# EAGLE schematic self-balancing-robot (EAGLE 9.6.2)
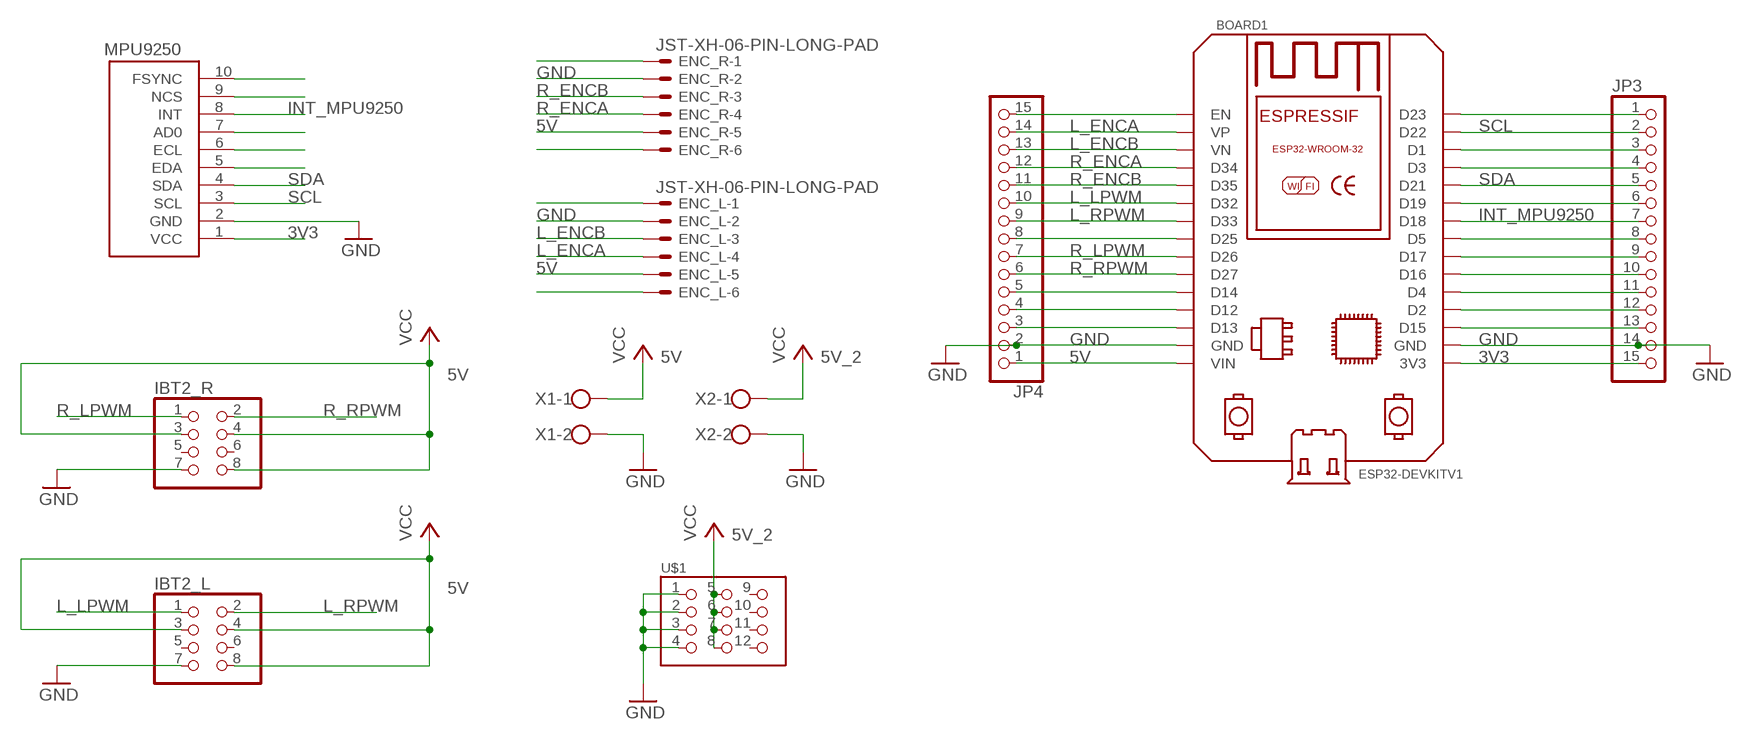
[diagram p0: schematic, sheet 1]

## Parts
BOARD1  ESP32DEVKITV1  [ESP32-DEVKITV1]
ENC_L  JST-XH-06-PIN-LONG-PAD  [JST-XH-06-PACKAGE-LONG-PAD]
ENC_R  JST-XH-06-PIN-LONG-PAD  [JST-XH-06-PACKAGE-LONG-PAD]
IBT2_L  PINHD-2X4  [2X04]
IBT2_R  PINHD-2X4  [2X04]
JP3  PINHD-1X15  [1X15]
JP4  PINHD-1X15  [1X15]
MPU9250  IMU-MODULE  [IMU-MODULE]
U$1  PIN_3X4  [PIN_3X4]
X1  W237-102  [W237-102]
X2  W237-102  [W237-102]

## Nets
3V3: BOARD1.3V3 JP3.15 MPU9250.1(VCC)
5V: BOARD1.VIN ENC_L.5 ENC_R.5 IBT2_L.3 IBT2_L.4 IBT2_L.8 IBT2_R.3 IBT2_R.4 IBT2_R.8 JP4.1 X1.1 ; supply symbol labelled VCC
5V_2: U$1.5 U$1.6 U$1.7 U$1.8 X2.1 ; supply symbol labelled VCC
GND: BOARD1.GND BOARD1.GND@1(GND) ENC_L.2 ENC_R.2 IBT2_L.7 IBT2_R.7 JP3.14 JP4.2 MPU9250.2(GND) U$1.1 U$1.2 U$1.3 U$1.4 X1.2 X2.2
INT_MPU9250: BOARD1.D18 JP3.7 MPU9250.8(INT)
L_ENCA: BOARD1.VP ENC_L.4 JP4.14
L_ENCB: BOARD1.VN ENC_L.3 JP4.13
L_LPWM: BOARD1.D32 IBT2_L.1 JP4.10
L_RPWM: BOARD1.D33 IBT2_L.2 JP4.9
N$1: BOARD1.D23 JP3.1
N$3: BOARD1.D1 JP3.3
N$4: BOARD1.D3 JP3.4
N$5: ENC_R.1
N$6: BOARD1.D19 JP3.6
N$8: BOARD1.D5 JP3.8
N$9: BOARD1.D17 JP3.9
N$10: BOARD1.D16 JP3.10
N$11: BOARD1.D4 JP3.11
N$12: BOARD1.D2 JP3.12
N$13: BOARD1.D15 JP3.13
N$16: BOARD1.EN JP4.15
N$23: BOARD1.D25 JP4.8
N$24: ENC_R.6
N$25: ENC_L.1
N$26: BOARD1.D14 JP4.5
N$27: BOARD1.D12 JP4.4
N$28: BOARD1.D13 JP4.3
N$31: MPU9250.10(FSYNC)
N$32: MPU9250.9(NCS)
N$34: MPU9250.7(AD0)
N$35: MPU9250.6(ECL)
N$36: MPU9250.5(EDA)
N$38: ENC_L.6
R_ENCA: BOARD1.D34 ENC_R.4 JP4.12
R_ENCB: BOARD1.D35 ENC_R.3 JP4.11
R_LPWM: BOARD1.D26 IBT2_R.1 JP4.7
R_RPWM: BOARD1.D27 IBT2_R.2 JP4.6
SCL: BOARD1.D22 JP3.2 MPU9250.3(SCL)
SDA: BOARD1.D21 JP3.5 MPU9250.4(SDA)
Unconnected: IBT2_L.5 IBT2_L.6 IBT2_R.5 IBT2_R.6 U$1.9 U$1.10 U$1.11 U$1.12

## Library data of the parts
BOARD1 = ESP32-DEVKITV1:ESP32DEVKITV1: https://github.com/shridattdudhat
ENC_L ENC_R = Rembrandt Electronics - JST XH Connectors v1-0:JST-XH-06-PIN: JST XH Connector 2 Pin Wire to board connector. Pitch: 2,54 mm, (0.100") Number of pins: 6 Created by Rembrandt Electronics www.rembrandtelectronics.com
IBT2_L IBT2_R = pinhead-long:PINHD-2X4: PIN HEADER
JP3 JP4 = pinhead:PINHD-1X15: PIN HEADER
MPU9250 = HiLetgo-IMU-Module:IMU-MODULE: HiLetgo MPU9250 / 6500 <https://www.amazon.co.jp/dp/B0154PM102> Module
U$1 = pinhead_3row-modified:PIN_3X4
X1 X2 = con-wago-500:W237-102: WAGO SCREW CLAMP; MPN: 237-102; OC_FARNELL: unknown; OC_NEWARK: 70K9898